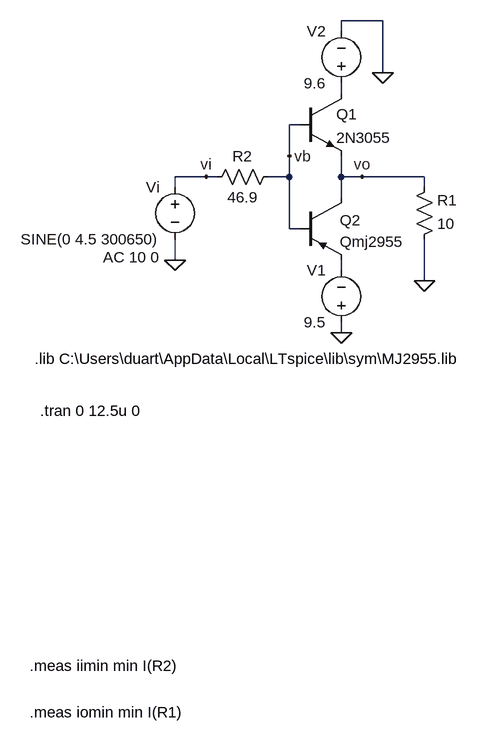
[diagram p0: schematic Lab3.asc]
Lab3.asc, the LTspice schematic file:
Version 4
SHEET 1 1180 1080
WIRE 288 -112 224 -112
WIRE 224 -96 224 -112
WIRE 288 -32 288 -112
WIRE 224 0 224 -16
WIRE 160 48 144 48
WIRE 144 96 144 48
WIRE 16 128 -32 128
WIRE 32 128 16 128
WIRE 144 128 144 96
WIRE 144 128 112 128
WIRE 224 128 224 96
WIRE 256 128 224 128
WIRE 352 128 256 128
WIRE -32 144 -32 128
WIRE 352 144 352 128
WIRE 224 160 224 128
WIRE 144 208 144 128
WIRE 160 208 144 208
WIRE -32 256 -32 224
WIRE 224 272 224 256
WIRE 352 288 352 224
WIRE 224 368 224 352
FLAG 224 368 0
FLAG 352 288 0
FLAG 288 -32 0
FLAG -32 256 0
FLAG 16 128 vi
FLAG 144 96 vb
FLAG 256 128 vo
SYMBOL npn 160 0 R0
SYMATTR InstName Q1
SYMATTR Value 2N3055
SYMBOL voltage 224 368 R180
WINDOW 0 24 96 Left 2
WINDOW 3 24 16 Left 2
WINDOW 123 0 0 Left 0
WINDOW 39 0 0 Left 0
SYMATTR InstName V1
SYMATTR Value 9.5
SYMBOL res 336 240 M180
WINDOW 0 36 76 Left 2
WINDOW 3 36 40 Left 2
SYMATTR InstName R1
SYMATTR Value 10
SYMBOL voltage 224 0 R180
WINDOW 0 24 96 Left 2
WINDOW 3 24 16 Left 2
WINDOW 123 0 0 Left 0
WINDOW 39 0 0 Left 0
SYMATTR InstName V2
SYMATTR Value 9.6
SYMBOL voltage -32 128 M0
WINDOW 123 24 124 Left 2
WINDOW 39 24 152 Left 2
SYMATTR Value2 AC 10 0
SYMATTR InstName Vi
SYMATTR Value SINE(0 4.5 300650)
SYMBOL res 128 112 R90
WINDOW 0 0 56 VBottom 2
WINDOW 3 32 56 VTop 2
SYMATTR InstName R2
SYMATTR Value 46.9
SYMBOL pnp 160 160 R0
WINDOW 0 62 35 Left 2
WINDOW 3 62 68 Left 2
SYMATTR InstName Q2
SYMATTR Value Qmj2955
TEXT -248 408 Left 2 !.lib C:\\Users\\duart\\AppData\\Local\\LTspice\\lib\\sym\\MJ2955.lib
TEXT -256 952 Left 2 !.meas iomin min I(R1)
TEXT -256 880 Left 2 !.meas iimin min I(R2)
TEXT -240 488 Left 2 !.tran 0 12.5u 0

The netlist it stands for:
* Lab3.asc
Q1 N001 vb vo 0 2N3055
V1 0 N002 9.5
R1 0 vo 10
V2 N001 0 9.6
Vi vi 0 SINE(0 4.5 300650) AC 10 0
R2 vb vi 46.9
Q2 vo vb N002 0 Qmj2955
.model NPN NPN
.model PNP PNP
.lib standard.bjt
.lib C:\Users\duart\AppData\Local\LTspice\lib\sym\MJ2955.lib
.meas iomin min I(R1)
.meas iimin min I(R2)
.tran 0 12.5u 0
.backanno
.end